# EAGLE design Turntable (EAGLE 9.5.2)
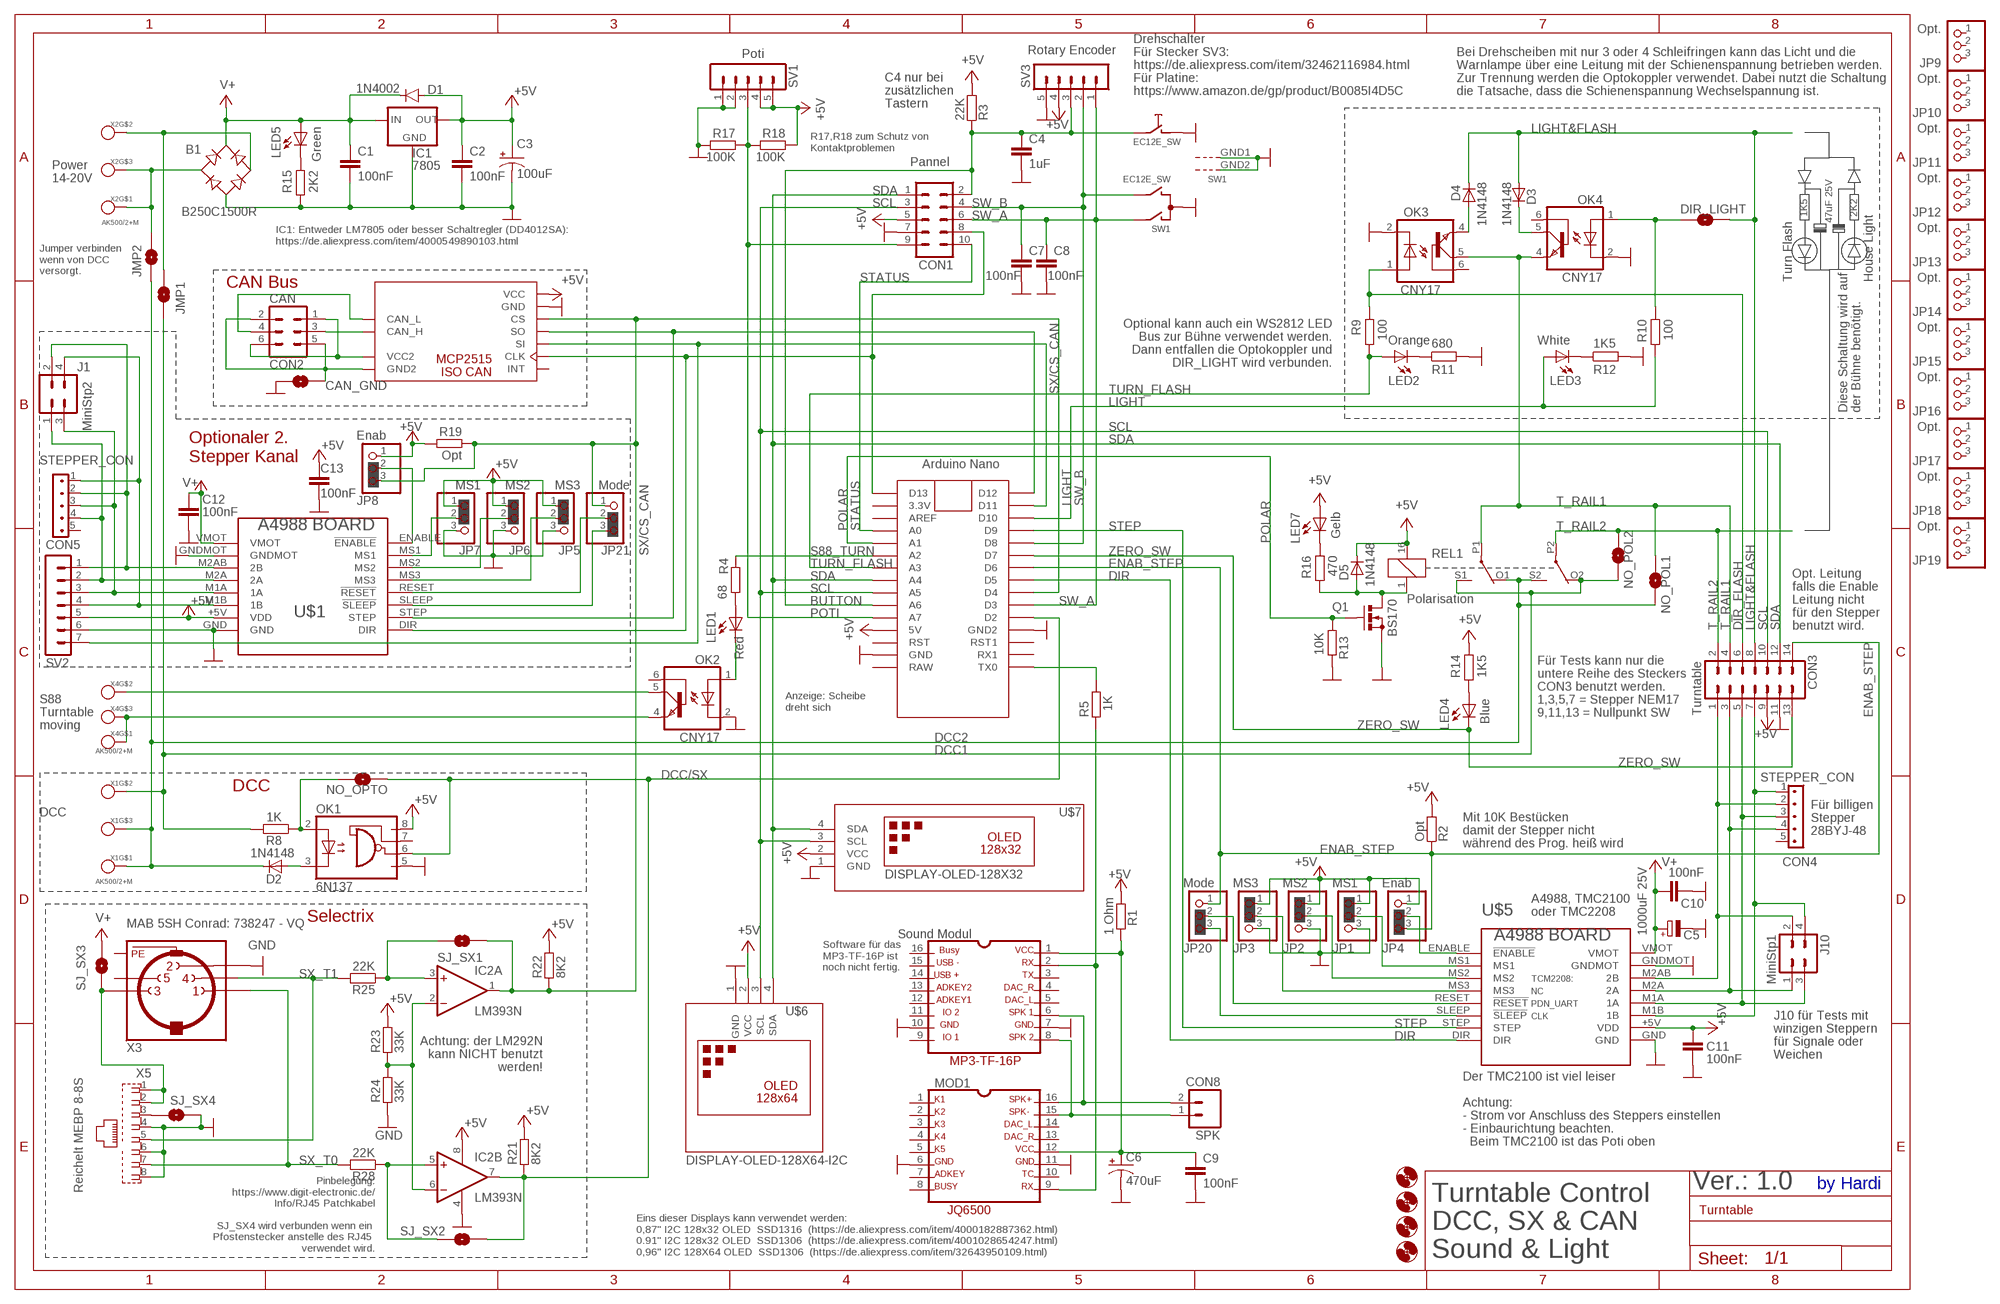
[diagram p0: schematic, sheet 1]

## Parts
B1  B250C1500R  RB1A  [RB1A]
C1  100nF  C-EU050-024X044  [C050-024X044]
C2  100nF  C-EU050-024X044  [C050-024X044]
C3  100uF  SPARKFUN-CAPACITORS_100UF-25V-20%(PTH)  [SPARKFUN-CAPACITORS_CPOL-RADIAL-100UF-25V]
C4  1uF  C-EU050-024X044  [C050-024X044]
C5  1000uF 25V  CPOL-EUE5-10.5  [E5-10,5]
C6  470uF  SPARKFUN-CAPACITORS_100UF-25V-20%(PTH)  [SPARKFUN-CAPACITORS_CPOL-RADIAL-100UF-25V]
C7  100nF  C-EU050-024X044  [C050-024X044]
C8  100nF  C-EU050-024X044  [C050-024X044]
C9  100nF  C-EU050-024X044  [C050-024X044]
C10  100nF  C-EU050-024X044  [C050-024X044]
C11  100nF  C-EU050-024X044  [C050-024X044]
C12  100nF  C-EU050-024X044  [C050-024X044]
C13  100nF  C-EU050-024X044  [C050-024X044]
CAN1  MCP2515_ISO_CAN  [MCP2515_ISO_CAN]
CAN_GND  SOLDERJUMPERNO  [SJ_2S-NO]
CON1  Pannel  ML10  [ML10]
CON2  CAN  ML6  [ML6]
CON3  Turntable  ML14  [ML14]
CON4  STEPPER_CON  [STEPPER_CON]
CON5  STEPPER_CON  [STEPPER_CON]
CON8  SPK  M02PTH  [1X02]
D1  1N4002  1N4004  [DO41-10]
D2  1N4148  1N4148DO35-7  [DO35-7]
D3  1N4148  1N4148DO35-7  [DO35-7]
D4  1N4148  1N4148DO35-7  [DO35-7]
D5  1N4148  1N4148DO35-7  [DO35-7]
DIR_LIGHT  SOLDERJUMPERNO  [SJ_2S-NO]
H1  MOUNT-HOLE3.0  [3,0]
H2  MOUNT-HOLE3.0  [3,0]
H3  MOUNT-HOLE3.0  [3,0]
H4  MOUNT-HOLE3.0  [3,0]
IC1  7805  78XXS  [78XXS]
IC2  LM393N  [DIL08]
J1  MiniStp2  CON-HARTING-ML_ML4  [CON-HARTING-ML_ML4]
J10  MiniStp1  CON-HARTING-ML_ML4  [CON-HARTING-ML_ML4]
JMP1  SOLDERJUMPERNO  [SJ_2S-NO]
JMP2  SOLDERJUMPERNO  [SJ_2S-NO]
JP1  MS1  PINHD-1X3CB  [1X03-CLEANBIG]
JP2  MS2  PINHD-1X3CB  [1X03-CLEANBIG]
JP3  MS3  PINHD-1X3CB  [1X03-CLEANBIG]
JP4  Enab  PINHD-1X3CB  [1X03-CLEANBIG]
JP5  MS3  PINHD-1X3CB  [1X03-CLEANBIG]
JP6  MS2  PINHD-1X3CB  [1X03-CLEANBIG]
JP7  MS1  PINHD-1X3CB  [1X03-CLEANBIG]
JP8  Enab  PINHD-1X3CB  [1X03-CLEANBIG]
JP9  Opt.  PINHD-1X3CB  [1X03-CLEANBIG]
JP10  Opt.  PINHD-1X3CB  [1X03-CLEANBIG]
JP11  Opt.  PINHD-1X3CB  [1X03-CLEANBIG]
JP12  Opt.  PINHD-1X3CB  [1X03-CLEANBIG]
JP13  Opt.  PINHD-1X3CB  [1X03-CLEANBIG]
JP14  Opt.  PINHD-1X3CB  [1X03-CLEANBIG]
JP15  Opt.  PINHD-1X3CB  [1X03-CLEANBIG]
JP16  Opt.  PINHD-1X3CB  [1X03-CLEANBIG]
JP17  Opt.  PINHD-1X3CB  [1X03-CLEANBIG]
JP18  Opt.  PINHD-1X3CB  [1X03-CLEANBIG]
JP19  Opt.  PINHD-1X3CB  [1X03-CLEANBIG]
JP20  Mode  PINHD-1X3CB  [1X03-CLEANBIG]
JP21  Mode  PINHD-1X3CB  [1X03-CLEANBIG]
LED1  Red  LED3MM  [LED3MM]
LED2  Orange  LED3MM  [LED3MM]
LED3  White  LED3MM  [LED3MM]
LED4  Blue  LED3MM  [LED3MM]
LED5  Green  LED3MM  [LED3MM]
LED7  Gelb  LED3MM  [LED3MM]
MOD1  JQ6500  [JQ6500]
MOD2  Sound Modul  MP3-TF-16P_MP3-TF-16P  [MP3-TF-16P_MP3-TF-16P]
NO_OPTO  SOLDERJUMPERNO  [SJ_2S-NO]
NO_POL1  SOLDERJUMPERNO  [SJ_2S-NO]
NO_POL2  SOLDERJUMPERNO  [SJ_2S-NO]
OK1  6N137  [DIL08]
OK2  CNY17  [DIL06]
OK3  CNY17  [DIL06]
OK4  CNY17  [DIL06]
Q1  BS170  [SOT54E]
R1  1 Ohm  RCL_R-EU_0204/7  [RCL_0204/7]
R2  Opt  R-EU_0204/7  [0204/7]
R3  22K  R-EU_0204/7  [0204/7]
R4  68  R0204/7  [0204/7]
R5  1K  R0204/7  [0204/7]
R8  1K  R0204/7  [0204/7]
R9  100  R0204/7  [0204/7]
R10  100  R0204/7  [0204/7]
R11  680  R0204/7  [0204/7]
R12  1K5  R0204/7  [0204/7]
R13  10K  R0204/7  [0204/7]
R14  1K5  R0204/7  [0204/7]
R15  2K2  R0204/7  [0204/7]
R16  470  R0204/7  [0204/7]
R17  100K  R-EU_0204/7  [0204/7]
R18  100K  R-EU_0204/7  [0204/7]
R19  Opt  R-EU_0204/7  [0204/7]
R21  8K2  R-EU_0204/7  [0204/7]
R22  8K2  R-EU_0204/7  [0204/7]
R23  33K  R-EU_0204/7  [0204/7]
R24  33K  R-EU_0204/7  [0204/7]
R25  22K  R-EU_0204/7  [0204/7]
R28  22K  R-EU_0204/7  [0204/7]
REL1  Polarisation  351  [351]
SJ_SX1  SOLDERJUMPERNO  [SJ_2S-NO]
SJ_SX2  SOLDERJUMPERNO  [SJ_2S-NO]
SJ_SX3  SOLDERJUMPERNO  [SJ_2S-NO]
SJ_SX4  SOLDERJUMPERNO  [SJ_2S-NO]
SV1  Poti  MA05-1  [MA05-1]
SV2  MA07-1  [MA07-1]
SV3  Rotary Encoder  MA05-1SMALL_PAD  [MA05-1_SMALL_PAD]
SW1  EC12E_SW  [ALPS_EC12E_SW]
U2  LED NANO  NANO  [NANO]
U$1  BOARD_A4988  [BOARD_A4988]
U$5  BOARD_A4988  [BOARD_A4988]
U$6  DISPLAY-OLED-128X64-I2C  [DISPLAY-OLED-128X64-I2C]
U$7  DISPLAY-OLED-128X32  [DISPLAY-OLED-128X32]
X1  AK500/2+M  [AK500/2+M]
X2  AK500/2+M  [AK500/2+M]
X3  MAB 5SH Conrad: 738247 - VQ  MAB5SH  [MAB5SH]
X4  AK500/2+M  [AK500/2+M]
X5  Reichelt MEBP 8-8S  RJ45_MEBP8-8S  [RJ45_MEBP8-8S]

## Nets
+5V: C2.1 C3.1(+) C11.1 C13.1 CON1.5 CON3.9 D1.A D5.C IC1.OUT IC2.8(P:V+) JP1.1 JP2.1 JP3.1 JP4.1 JP5.1 JP6.1 JP7.1 JP8.1 LED7.A OK1.8(VCC) R1.1 R2.2 R3.2 R14.1 R18.1 R19.2 R21.2 R22.2 R23.2 REL1.16 SV1.4 SV1.5 SV2.5 SV3.4 U2.5V U$1.+5V(VDD) U$5.+5V(VDD) U$6.2(VCC) U$7.2(VCC)
BUTTON: C4.1 CON1.2 R3.1 SV3.3 SW1.E U2.A6
CAN_H: CAN1.9(CAN_H) CON2.3
CAN_L: CAN1.8(CAN_L) CON2.4
D11: CAN1.5(SI) SV2.7 U2.D11
D12: CAN1.4(SO) U2.D12 U$1.STEP
DCC1: JMP1.2 NO_POL2.2 R8.2 REL1.O2(3:O) REL1.S1(2:S) X1.2
DCC2: D2.C JMP2.2 NO_POL1.2 REL1.O1(2:O) REL1.S2(3:S) X1.1 X1.M
DCC/SX: IC2.7(B:OUT) NO_OPTO.1 OK1.6(VO) R21.1 SJ_SX2.2 U2.D2
DIR: U2.D5 U$5.DIR
DIR_FLASH: CON3.6 OK3.1(A) R9.1
ENAB_STEP: CON3.14 JP4.3 JP20.1 R2.1 U2.D6
GND: B1.- C1.2 C2.2 C3.2(-) C4.2 C5.- C6.2(-) C7.2 C8.2 C9.2 C10.2 C11.2 C12.2 C13.2 CAN1.2(GND) CAN_GND.2 CON1.7 CON3.11 IC1.GND IC2.4(P:V-) JP1.3 JP2.3 JP3.3 JP5.3 JP6.3 JP7.3 MOD1.6 MOD1.11 MOD2.7 MOD2.10 OK1.5(GND) OK2.2(C) OK3.2(C) OK4.2(C) Q1.S R11.2 R12.2 R13.2 R15.2 R17.2 R24.1 SJ_SX4.2 SV1.1 SV1.2 SV2.6 SV3.5 SW1.C SW1.D SW1.GND1(G) SW1.GND2(G) U2.GND U2.GND1(GND2) U$1.GND U$1.GNDMOT U$5.GND U$5.GNDMOT U$6.1(GND) U$7.1(GND) X3.2 X5.4 X5.6 X5.8
LIGHT: LED3.A R10.2 U2.D10
LIGHT&FLASH: CON3.8 D3.A D4.C DIR_LIGHT.2
N$1: JP5.2 U$1.MS3
N$2: SJ_SX4.1 X5.3
N$3: CAN1.11(GND2) CAN_GND.1 CON2.2 CON2.5
N$4: C6.1(+) C9.1 MOD1.12 MOD2.1 R1.2
N$5: CAN1.6(CLK) CON1.8 U2.D13 U$1.DIR
N$6: CON8.1 MOD1.15 MOD2.8
N$7: MOD1.9 MOD2.2 R5.1
N$8: LED1.K(C) OK2.1(A)
N$9: CON8.2 MOD1.16 MOD2.6
N$10: CAN1.10(VCC2) CON2.1 CON2.6
N$11: R5.2 U2.TX0
N$12: B1.AC2 JMP1.1 X2.2
N$13: B1.AC1 JMP2.1 X2.1 X2.M
N$14: JP2.2 U$5.MS2
N$15: D2.A OK1.3(C)
N$16: LED2.K(C) R11.1
N$17: D5.A Q1.D R16.2 REL1.1
N$18: LED1.A R4.1
N$19: OK2.4(EMI) X4.1 X4.M
N$20: OK2.5(COL) X4.2
N$21: NO_OPTO.2 OK1.2(A) R8.1
N$22: JP1.2 U$5.MS1
N$23: LED3.K(C) R12.1
N$24: LED4.A R14.2
N$25: JP4.2 U$5.ENABLE(!ENABLE)
N$26: SJ_SX3.1 X3.3 X5.1 X5.2
N$27: JP3.2 U$5.MS3
N$28: D4.A OK3.4(EMI)
N$29: D3.C OK4.5(COL)
N$30: JP20.2 U$5.RESET(!RESET)
N$31: CON3.1 CON4.2 J10.2 U$5.M2AB(2B)
N$32: JP21.3 U$1.SLEEP(!SLEEP)
N$33: JP20.3 U$5.SLEEP(!SLEEP)
N$34: LED5.K(C) R15.1
N$35: CON3.7 CON4.1 J10.4 U$5.M1B(1B)
N$36: LED7.K(C) R16.1
N$37: DIR_LIGHT.1 OK4.1(A) R10.1
N$38: IC2.2(A:-IN) IC2.6(B:-IN) R23.1 R24.2
N$39: IC2.3(A:+IN) R25.1 SJ_SX1.1
N$40: CON3.3 CON4.4 J10.1 U$5.M2A(2A)
N$41: CON3.5 CON4.3 J10.3 U$5.M1A(1A)
N$42: IC2.5(B:+IN) R28.1 SJ_SX2.1
N$43: JP6.2 U$1.MS2
N$44: JP7.2 U$1.MS1
N$45: JP8.2 U$1.ENABLE(!ENABLE)
N$46: JP21.2 U$1.RESET(!RESET)
N$47: CON5.2 J1.2 SV2.1 U$1.M2AB(2B)
N$48: CON5.4 J1.1 SV2.2 U$1.M2A(2A)
N$49: CON5.3 J1.3 SV2.3 U$1.M1A(1A)
N$50: CON5.1 J1.4 SV2.4 U$1.M1B(1B)
POLAR: Q1.G R13.1 U2.A1
POTI: CON1.9 R17.1 R18.2 SV1.3 U2.A7
S88_TURN: R4.2 U2.A2
SCL: CON1.3 CON3.10 U2.A5 U$6.3(SCL) U$7.3(SCL)
SDA: CON1.1 CON3.12 U2.A4 U$6.4(SDA) U$7.4(SDA)
STATUS: CON1.10 U2.A0
STEP: U2.D9 U$5.STEP
SW_A: C8.1 CON1.6 SV3.1 SW1.A U2.D3
SW_B: C7.1 CON1.4 SV3.2 SW1.B U2.D8
SX/CS_CAN: CAN1.3(CS) IC2.1(A:OUT) JP8.3 JP21.1 R19.1 R22.1 SJ_SX1.2 U2.D4
SX_T0: R28.2 X3.1 X5.7
SX_T1: R25.2 X3.4 X5.5
T_RAIL1: CON3.4 NO_POL1.1 OK3.5(COL) OK4.4(EMI) REL1.P1(2:P)
T_RAIL2: CON3.2 NO_POL2.1 REL1.P2(3:P)
TURN_FLASH: LED2.A R9.2 U2.A3
V+: B1.+ C1.1 C5.+ C10.1 C12.1 D1.C IC1.IN LED5.A SJ_SX3.2 U$1.VMOT U$5.VMOT
VCC: CAN1.1(VCC) ; supply symbol labelled +5V
ZERO_SW: CON3.13 LED4.K(C) U2.D7
Unconnected: CAN1.7(INT) CON4.5 CON5.5 JP9.1 JP9.2 JP9.3 JP10.1 JP10.2 JP10.3 JP11.1 JP11.2 JP11.3 JP12.1 JP12.2 JP12.3 JP13.1 JP13.2 JP13.3 JP14.1 JP14.2 JP14.3 JP15.1 JP15.2 JP15.3 JP16.1 JP16.2 JP16.3 JP17.1 JP17.2 JP17.3 JP18.1 JP18.2 JP18.3 JP19.1 JP19.2 JP19.3 MOD1.1 MOD1.2 MOD1.3 MOD1.4 MOD1.5 MOD1.7 MOD1.8 MOD1.10 MOD1.13 MOD1.14 MOD2.3 MOD2.4 MOD2.5 MOD2.9 MOD2.11 MOD2.12 MOD2.13 MOD2.14 MOD2.15 MOD2.16 OK1.7(VE) OK2.6(BAS) OK3.6(BAS) OK4.6(BAS) U2.3.3V U2.AREF U2.RAW U2.RST U2.RST1 U2.RX1 X3.5

## Notes on the sheet
- Drehschalter
  Für Stecker SV3:
  https://de.aliexpress.com/item/32462116984.html
  Für Platine:
  https://www.amazon.de/gp/product/B0085I4D5C
- Bei Drehscheiben mit nur 3 oder 4 Schleifringen kann das Licht und die 
  Warnlampe über eine Leitung mit der Schienenspannung betrieben werden.
  Zur Trennung werden die Optokoppler verwendet. Dabei nutzt die Schaltung
  die Tatsache, dass die Schienenspannung Wechselspannung ist.
- C4 nur bei
  zusätzlichen
  Tastern
- R17,R18 zum Schutz von 
  Kontaktproblemen
- Power
  14-20V
- 1K5 | 2K2
- 47uF 25V
- IC1: Entweder LM7805 oder besser Schaltregler (DD4012SA):
  https://de.aliexpress.com/item/4000549890103.html
- Jumper verbinden
  wenn von DCC
  versorgt.
- CAN Bus
- Turn Flash | House Light
- Optional kann auch ein WS2812 LED
  Bus zur Bühne verwendet werden.
  Dann entfallen die Optokoppler und
  DIR_LIGHT wird verbunden.
- Diese Schaltung wird auf
  der Bühne benötigt.
- Optionaler 2.
  Stepper Kanal
- Opt. Leitung
  falls die Enable
  Leitung nicht 
  für den Stepper
  benutzt wird.
- Anzeige: Scheibe 
  dreht sich
- Für Tests kann nur die
  untere Reihe des Steckers
  CON3 benutzt werden.
  1,3,5,7 = Stepper NEM17
  9,11,13 = Nullpunkt SW
- S88
  Turntable
  moving
- DCC
- DCC
- Für billigen
  Stepper
  28BYJ-48
- Mit 10K Bestücken
  damit der Stepper nicht
  während des Prog. heiß wird
- Selectrix
- A4988, TMC2100
  oder TMC2208
- Software für das
  MP3-TF-16P ist 
  noch nicht fertig.
- TCM2208:
  NC
  PDN_UART
  CLK
- J10 für Tests mit
  winzigen Steppern
  für Signale oder
  Weichen
- Achtung: der LM292N
  kann NICHT benutzt
  werden!
- Der TMC2100 ist viel leiser
  
  Achtung: 
  - Strom vor Anschluss des Steppers einstellen
  - Einbaurichtung beachten.
    Beim TMC2100 ist das Poti oben
- Pinbelegung:
  https://www.digit-electronic.de/
  Info/RJ45 Patchkabel
  
  SJ_SX4 wird verbunden wenn ein 
  Pfostenstecker anstelle des RJ45 
  verwendet wird.
- Ver.: 1.0 | by Hardi
- Eins dieser Displays kann verwendet werden:
  0,87" I2C 128x32 OLED  SSD1316  (https://de.aliexpress.com/item/4000182887362.html)
  0.91" I2C 128x32 OLED  SSD1306  (https://de.aliexpress.com/item/4001028654247.html)
  0,96" I2C 128X64 OLED  SSD1306  (https://de.aliexpress.com/item/32643950109.html)
- Turntable Control
  DCC, SX & CAN
  Sound & Light

## Power pins joined to a net without a drawn wire
PE: X3.PE X3.PE@(PE)

## Library data of the parts
B1 = rectifier:RB1A: RECTIFIER 1 A
C1 C2 C4 C7-C13 = resistor:C-EU: CAPACITOR, European symbol
C3 C6 = Sound_MP3-TF-16P_and_WS2811:SPARKFUN-CAPACITORS_100UF-25V-20%(PTH): CAP-08439; PROD_ID: CAP-08439
C5 = resistor:CPOL-EU: POLARIZED CAPACITOR, European symbol
CAN1 = Arduino_fuer_LEDs_DCC_2_All:MCP2515_ISO_CAN: MCP2515 CAN Modul
CAN_GND DIR_LIGHT JMP1 JMP2 NO_OPTO NO_POL1 NO_POL2 SJ_SX1-SJ_SX4 = SparkFun-Retired:SOLDERJUMPER: Solder Jumper Standard SMD solder jumper. Used to automate production. Two varients : Normally Open and Normally Closed are the same, but have different paste layers. NC will have a large amount of paste and should jumper during reflow.
CON1 = con-harting-ml:ML10: HARTING; OC_FARNELL: unknown; OC_NEWARK: unknown
CON2 = Arduino_fuer_LEDs_DCC_2:ML6: HARTING; OC_FARNELL: unknown; OC_NEWARK: unknown
CON3 = Arduino_fuer_LEDs_DCC_2:ML14: HARTING; OC_FARNELL: unknown; OC_NEWARK: unknown
CON4 CON5 = Connectors_Inline3_7:STEPPER_CON
CON8 = SparkFun-Connectors:M02: Standard 2-pin 0.1" header. Use with - straight break away headers ( PRT-00116) - right angle break away headers (PRT-00553) - swiss pins (PRT-00743) - machine pins (PRT-00117) - female headers (PRT-00115) Molex polarized connector foot print use with: PRT-08233 with associated crimp pins and housings. 2.54_SCREWTERM for use with PRT-10571. 3.5mm Screw Terminal footprints for PRT-08084 5mm Screw Terminal footprints for use with PRT-08432
D1 = diode:1N4004: DIODE general purpose rectifier, 1 A
D2-D5 = diode:1N4148: DIODE high speed (Philips)
H1-H4 = holes:MOUNT-HOLE: MOUNTING HOLE with drill center marker
IC1 = v-reg:78XXS: VOLTAGE REGULATOR
IC2 = linear:LM393: COMPARATOR
J1 J10 = Pfostenstecker_4_u_6:CON-HARTING-ML_ML4
JP1-JP21 = adafruit:PINHD-1X3: PIN HEADER
LED1-LED5 LED7 = Arduino_fuer_LEDs_DCC_2:LED: LED OSRAM: - CHIPLED LG R971, LG N971, LY N971, LG Q971, LY Q971, LO R971, LY R971 LH N974, LH R974 LS Q976, LO Q976, LY Q976 LO Q996 - Hyper CHIPLED LW Q18S LB Q993, LB Q99A, LB R99A - SideLED LS A670, LO A670, LY A670, LG A670, LP A670 LB A673, LV A673, LT A673, LW A673 LH A674 LY A675 LS A676, LA A676, LO A676, LY A676, LW A676 LS A679, LY A679, LG A679 - Hyper Micro SIDELED® LS Y876, LA Y876, LO Y876, LY Y876 LT Y87S - SmartLED LW L88C, LW L88S LB L89C, LB L89S, LG L890 LS L89K, LO L89K, LY L89K LS L896, LA L896, LO L896, LY L896 - TOPLED LS T670, LO T670, LY T670, LG T670, LP T670 LSG T670, LSP T670, LSY T670, LOP T670, LYG T670 LG T671, LOG T671, LSG T671 LB T673, LV T673, LT T673, LW T673 LH T674 LS T676, LA T676, LO T676, LY T676, LB T676, LH T676, LSB T676, LW T676 LB T67C, LV T67C, LT T67C, LS T67K, LO T67K, LY T67K, LW E67C LS E67B, LA E67B, LO E67B, LY E67B, LB E67C, LV E67C, LT E67C LW T67C LS T679, LY T679, LG T679 LS T770, LO T770, LY T770, LG T770, LP T770 LB T773, LV T773, LT T773, LW T773 LH T774 LS E675, LA E675, LY E675, LS T675 LS T776, LA T776, LO T776, LY T776, LB T776 LHGB T686 LT T68C, LB T68C - Hyper Mini TOPLED® LB M676 - Mini TOPLED Santana® LG M470 LS M47K, LO M47K, LY M47K Source: http://www.osram.convergy.de LUXEON: - LUMILED® LXK2-PW12-R00, LXK2-PW12-S00, LXK2-PW14-U00, LXK2-PW14-V00 LXK2-PM12-R00, LXK2-PM12-S00, LXK2-PM14-U00 LXK2-PE12-Q00, LXK2-PE12-R00, LXK2-PE12-S00, LXK2-PE14-T00, LXK2-PE14-U00 LXK2-PB12-K00, LXK2-PB12-L00, LXK2-PB12-M00, LXK2-PB14-N00, LXK2-PB14-P00, LXK2-PB14-Q00 LXK2-PR12-L00, LXK2-PR12-M00, LXK2-PR14-Q00, LXK2-PR14-R00 LXK2-PD12-Q00, LXK2-PD12-R00, LXK2-PD12-S00 LXK2-PH12-R00, LXK2-PH12-S00 LXK2-PL12-P00, LXK2-PL12-Q00, LXK2-PL12-R00 Source: www.luxeon.com KINGBRIGHT: KA-3528ASYC Source: www.kingbright.com
MOD1 = Sound_JQ6500:JQ6500: MP3-TF-16P http://www.electronicoscaldas.com/datasheet/DFR0299-DFPlayer-Mini-Manual.pdf; OC_FARNELL: unknown; OC_NEWARK: unknown
MOD2 = Sound_MP3-TF-16P_WS2811_and_ATTiny:MP3-TF-16P_MP3-TF-16P: MP3-TF-16P http://www.electronicoscaldas.com/datasheet/DFR0299-DFPlayer-Mini-Manual.pdf; OC_FARNELL: unknown; OC_NEWARK: unknown
OK1 = Arduino_fuer_LEDs_DCC_2:6N137: MOTOROLA OPTO COUPLER; MPN: 6N137; OC_FARNELL: 1328376; OC_NEWARK: 52M1895
OK2-OK4 = Arduino_fuer_LEDs_DCC_2:CNY17: SIEMENS OPTO COUPLER; MPN: CNY17-1; OC_FARNELL: 1045399; OC_NEWARK: 05M4044
Q1 = transistor-small-signal:BS170: N-CHANNEL MOS FET
R1 = Sound_MP3-TF-16P_and_WS2811:RCL_R-EU_: RESISTOR, European symbol; SPICEPREFIX: R
R2 R3 R17-R19 R21-R25 R28 = rcl:R-EU_: RESISTOR, European symbol
R4 R5 R8-R16 = Arduino_fuer_LEDs_DCC_2:R: RESISTOR, European symbol; SPICEMODEL: NONE; SPICEPREFIX: R
REL1 = relay:351: RELAY 2 x switch, Omron; OC_FARNELL: unknown; OC_NEWARK: unknown
SV1 = con-lstb:MA05-1: PIN HEADER; OC_FARNELL: unknown; OC_NEWARK: unknown
SV2 = con-lstb:MA07-1: PIN HEADER; OC_FARNELL: unknown; OC_NEWARK: unknown
SV3 = con-lstb:MA05-1: PIN HEADER
SW1 = switch-alps:EC12E_SW: ALPS rotary Encoder EC12E series with switch; MPN: EC12E2424407; OC_FARNELL: 1520813; OC_NEWARK: 74M1068
U2 = Arduino_fuer_LEDs_DCC_2:NANO: Arduino Nano
U$1 U$5 = Clean-Kong:BOARD_A4988
U$6 = diy-modules:DISPLAY-OLED-128X64-I2C: 128x64 Dot Matrix OLED Module based on SSD1306 chip Variant with I2C interface More details available here: http://www.instructables.com/id/Monochrome-096-i2c-OLED-display-with-arduino-SSD13/ SSD1306 datasheet: https://cdn-shop.adafruit.com/datasheets/SSD1306.pdf Click here to find device on ebay.com <http://www.ebay.com/sch/oled+display+128x64+iic> Note: There are two variants: I2C and SPI. Search for the proper version.
U$7 = diy-modules:DISPLAY-OLED-128X32: 128x32 Dot Matrix OLED Module with I2C interface based on SSD1306 chip More details available here: http://www.tinyosshop.com/index.php?route=product/product&product_id=953 Schematic available here: http://www.tinyosshop.com/datasheet/OLED%2012832.pdf SSD1306 datasheet: https://cdn-shop.adafruit.com/datasheets/SSD1306.pdf Click here to find device on ebay.com <http://www.ebay.com/sch/oled+display+128x32+i2c>
X1 X2 X4 = Arduino_fuer_LEDs_DCC_2:AK500/2+M
X3 = con-hirschmann:MAB5SH: Female CONNECTOR 5 pins 90 deg. with shield, horizontal (DIN 41524); OC_FARNELL: 809883; OC_NEWARK: unknown
X5 = RJ45_Reichelt:RJ45_MEBP8-8S: AMP connector

## Board
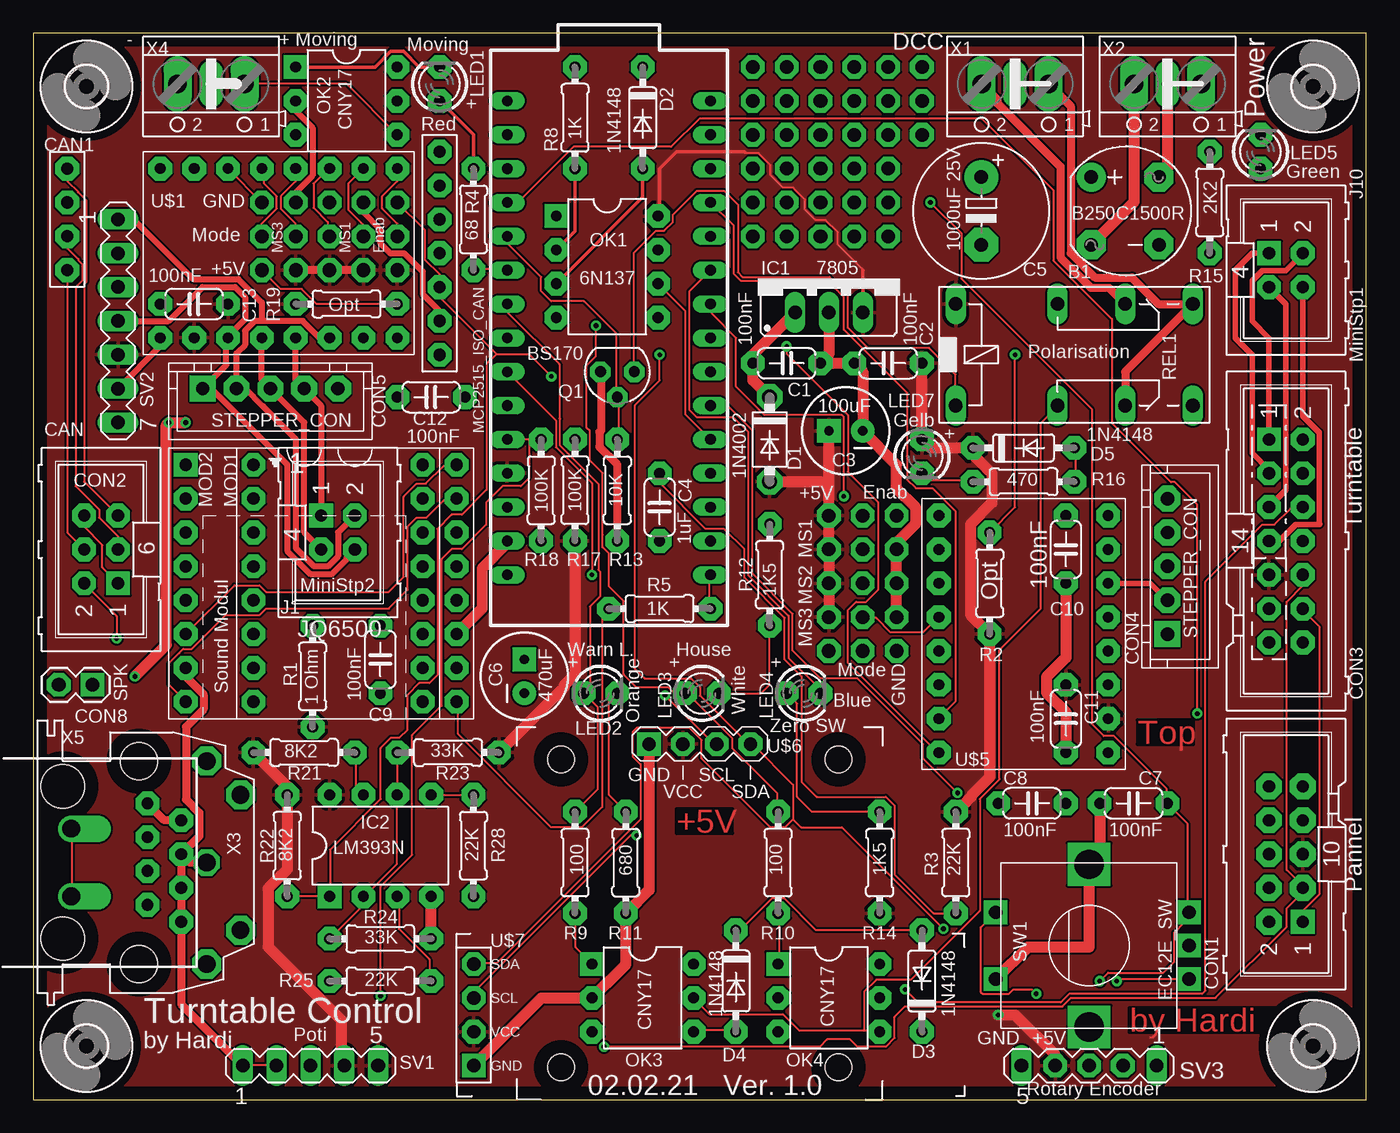
[diagram p1: board, top side]
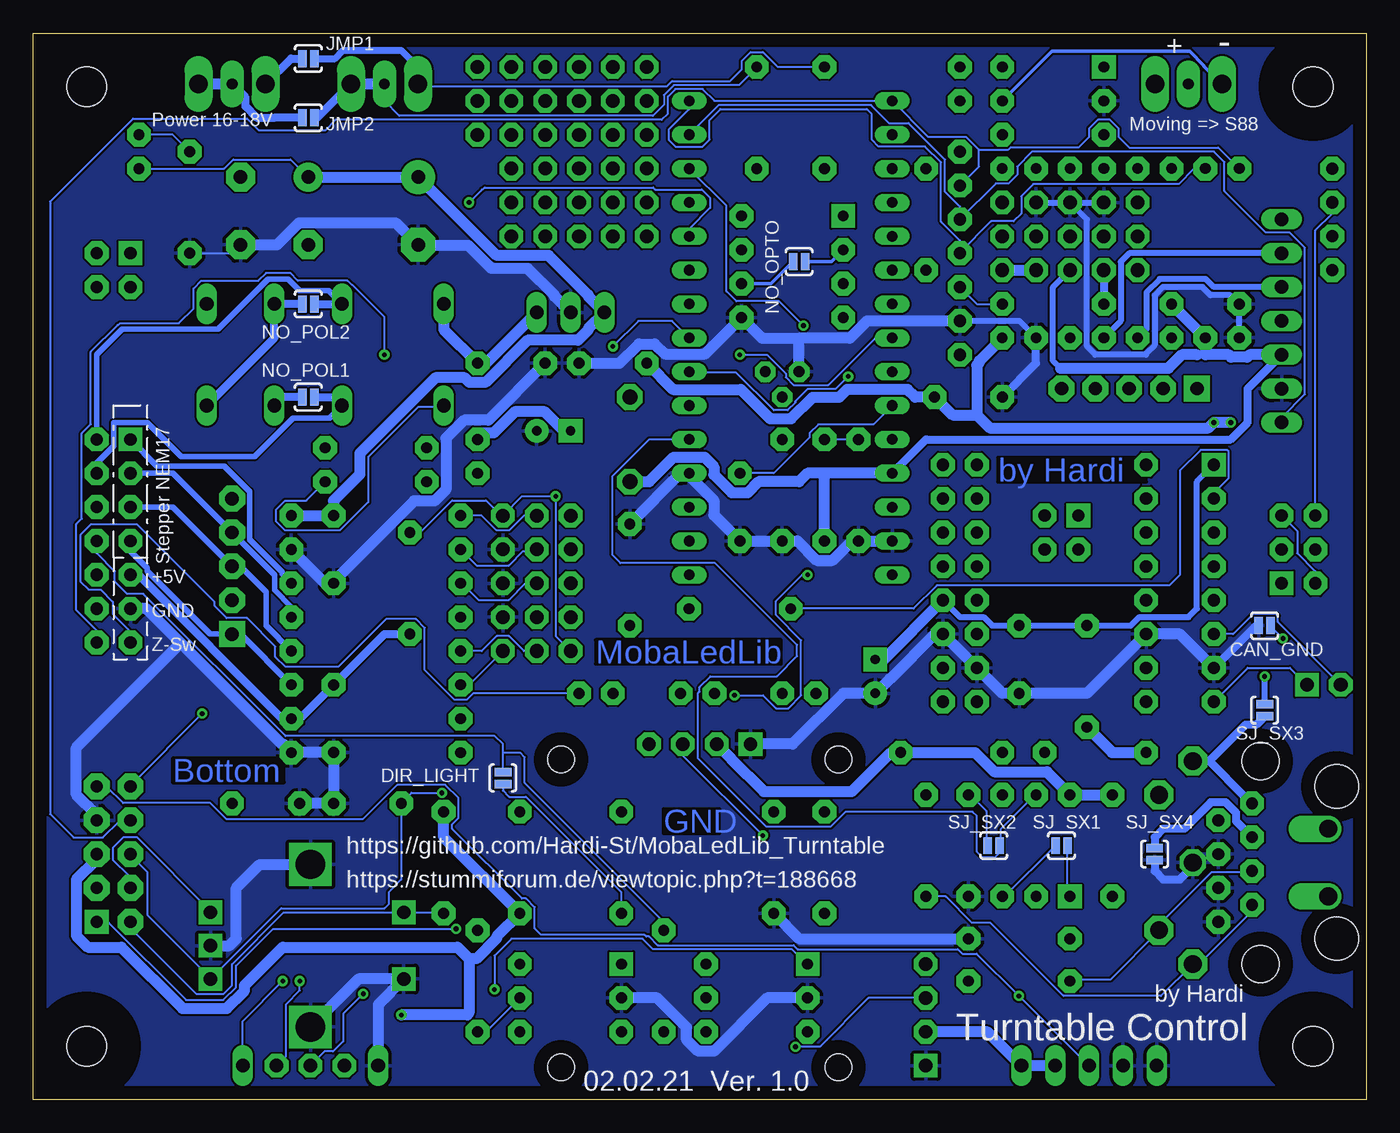
[diagram p2: board, bottom side, seen from below]

Size 100 x 80 mm. Coordinates in mm from the lower left corner, seen from the top.
Outline: 0,0 100,0 100,80 0,80 0,0
Copper layers (1*16): Top 0.035mm / dielectric 1.5mm / Bottom 0.035mm
Design rules "default *": minimum track width 6mil, minimum drill 0.35mm, track to track 6mil, track to pad 6mil, pad to pad 6mil, via to via 6mil, smd to smd 6mil, copper to edge 40mil, drill to drill 6mil, minimum pad ring 10mil, minimum via ring 8mil, stop-mask expansion 4mil, vias tented up to drill 0.5mm, thermal gap 10mil

### Footprints (pad centres in the part's own frame; a part is rotated, then mirrored left to right if it is on the bottom)
RB1A = drill 1.016 pad 2.184: + -2.54,2.54 | drill 1.016 pad 2.184 octagon: - 2.54,-2.54; AC1 2.54,2.54; AC2 -2.54,-2.54
C050-024X044 = drill 0.813 pad 1.778 octagon: 1 -2.54,0; 2 2.54,0
SPARKFUN-CAPACITORS_CPOL-RADIAL-100UF-25V = drill 0.7 pad 1.778 square: 1 1.27,0 | drill 0.7 pad 1.778: 2 -1.27,0
E5-10,5 = drill 1.016 pad 2.54: + -2.54,0 | drill 1.016 pad 2.54 octagon: - 2.54,0
MCP2515_ISO_CAN = drill 0.914 pad 1.778 octagon: 1 0,0; 2 0,-2.54; 3 0,-5.08; 4 0,-7.62; 5 0,-10.16; 6 0,-12.7; 7 0,-15.24; 8 27.94,-6.35; 9 27.94,-8.89; 10 27.94,-11.43; 11 27.94,-13.97
SJ_2S-NO = smd 0.635 x 1.27: 1 -0.45,0; 2 0.45,0
ML10 = drill 0.914 pad 1.778 square: 1 -5.08,-1.27 | drill 0.914 pad 1.93 octagon: 2 -5.08,1.27; 3 -2.54,-1.27; 4 -2.54,1.27; 5 0,-1.27; 6 0,1.27; 7 2.54,-1.27; 8 2.54,1.27; 9 5.08,-1.27; 10 5.08,1.27
ML6 = drill 0.914 pad 1.778 square: 1 -2.54,-1.27 | drill 0.914 pad 1.778 octagon: 2 -2.54,1.27; 3 0,-1.27; 4 0,1.27; 5 2.54,-1.27; 6 2.54,1.27
ML14 = drill 0.914 pad 1.778 square: 1 -7.62,-1.27 | drill 0.914 pad 1.778 octagon: 2 -7.62,1.27; 3 -5.08,-1.27; 4 -5.08,1.27; 5 -2.54,-1.27; 6 -2.54,1.27; 7 0,-1.27; 8 0,1.27; 9 2.54,-1.27; 10 2.54,1.27; 11 5.08,-1.27; 12 5.08,1.27; 13 7.62,-1.27; 14 7.62,1.27
STEPPER_CON = drill 1 pad 1.93 square: 1 0,0 | drill 1 pad 1.93 octagon: 2 2.54,0; 3 5.08,0; 4 7.62,0; 5 10.16,0
1X02 = drill 1.016 pad 1.778 square: 1 0,0 | drill 1.016 pad 1.778 octagon: 2 2.54,0
DO41-10 = drill 1.118 pad 1.93 octagon: A 3.175,0; C -3.175,0
DO35-7 = drill 0.813 pad 1.778 octagon: A 3.81,0; C -3.81,0
3,0 = hole 3: 0,0
78XXS = drill 1.016 long: GND 0,-2.54; IN -2.54,-2.54; OUT 2.54,-2.54
DIL08 = drill 0.813 pad 1.778 square: 1 -3.81,-3.81 | drill 0.813 pad 1.778 octagon: 2 -1.27,-3.81; 3 1.27,-3.81; 4 3.81,-3.81; 5 3.81,3.81; 6 1.27,3.81; 7 -1.27,3.81; 8 -3.81,3.81
CON-HARTING-ML_ML4 = drill 0.914 pad 1.778 square: 1 -2.54,-1.27 | drill 0.914 pad 1.778 octagon: 2 -2.54,1.27; 3 0,-1.27; 4 0,1.27
1X03-CLEANBIG = drill 1.016 pad 1.778 octagon: 1 -2.54,0; 2 0,0; 3 2.54,0
LED3MM = drill 0.813 pad 1.778 octagon: A -1.27,0; K 1.27,0
JQ6500 = drill 0.914 pad 1.778 octagon: 1 -8.89,16.51; 2 -8.89,13.97; 3 -8.89,11.43; 4 -8.89,8.89; 5 -8.89,6.35; 6 -8.89,3.81; 7 -8.89,1.27; 8 -8.89,-1.27; 9 6.35,-1.27; 10 6.35,1.27; 11 6.35,3.81; 12 6.35,6.35; 13 6.35,8.89; 14 6.35,11.43; 15 6.35,13.97; 16 6.35,16.51
MP3-TF-16P_MP3-TF-16P = drill 0.914 pad 1.778 square: 1 -8.89,16.51 | drill 0.914 pad 1.778 octagon: 2 -8.89,13.97; 3 -8.89,11.43; 4 -8.89,8.89; 5 -8.89,6.35; 6 -8.89,3.81; 7 -8.89,1.27; 8 -8.89,-1.27; 9 8.89,-1.27; 10 8.89,1.27; 11 8.89,3.81; 12 8.89,6.35; 13 8.89,8.89; 14 8.89,11.43; 15 8.89,13.97; 16 8.89,16.51
DIL06 = drill 0.813 pad 1.778 square: 1 -2.54,-3.81 | drill 0.813 pad 1.778 octagon: 2 0,-3.81; 3 2.54,-3.81; 4 2.54,3.81; 5 0,3.81; 6 -2.54,3.81
SOT54E = drill 0.813 pad 1.524 octagon: D -1.27,0; G 0,1.905; S 1.27,0
RCL_0204/7 = drill 0.813 pad 1.778 octagon: 1 -3.81,0; 2 3.81,0
0204/7 = drill 0.813 pad 1.778 octagon: 1 -3.81,0; 2 3.81,0
351 = drill 1.016 long: 1 -3.81,-3.81; 16 -3.81,3.81; O1 8.89,-3.81; O2 8.89,3.81; P1 3.81,-3.81; P2 3.81,3.81; S1 13.97,-3.81; S2 13.97,3.81
MA05-1 = drill 1.016 long: 1 -5.08,0; 2 -2.54,0; 3 0,0; 4 2.54,0; 5 5.08,0
MA07-1 = drill 1.016 long: 1 -7.62,0; 2 -5.08,0; 3 -2.54,0; 4 0,0; 5 2.54,0; 6 5.08,0; 7 7.62,0
MA05-1_SMALL_PAD = drill 1.016 long: 1 -5.08,0; 5 5.08,0 | drill 1.016 pad 1.778 octagon: 2 -2.54,0; 3 0,0; 4 2.54,0
ALPS_EC12E_SW = drill 1 pad 1.778 square: A -2.5,-7.5; B 2.5,-7.5; C 0,-7.5; D -2.5,7; E 2.5,7 | drill 2.2 square: GND1 -6.1,0; GND2 6.1,0
NANO = drill 0.8 long: 3.3V -10.16,24.13; 5V -10.16,-1.27; A0 -10.16,19.05; A1 -10.16,16.51; A2 -10.16,13.97; A3 -10.16,11.43; A4 -10.16,8.89; A5 -10.16,6.35; A6 -10.16,3.81; A7 -10.16,1.27; AREF -10.16,21.59; D2 5.08,1.27; D3 5.08,3.81; D4 5.08,6.35; D5 5.08,8.89; D6 5.08,11.43; D7 5.08,13.97; D8 5.08,16.51; D9 5.08,19.05; D10 5.08,21.59; D11 5.08,24.13; D12 5.08,26.67; D13 -10.16,26.67; GND -10.16,-6.35; GND1 5.08,-1.27; RAW -10.16,-8.89; RST -10.16,-3.81; RST1 5.08,-3.81; RX1 5.08,-6.35; TX0 5.08,-8.89
BOARD_A4988 = drill 0.8 pad 1.778 octagon: +5V 1.27,16.51; DIR 13.97,19.05; ENABLE 13.97,1.27; GND 1.27,19.05; GNDMOT 1.27,3.81; M1A 1.27,11.43; M1B 1.27,13.97; M2A 1.27,8.89; M2AB 1.27,6.35; MS1 13.97,3.81; MS2 13.97,6.35; MS3 13.97,8.89; RESET 13.97,11.43; SLEEP 13.97,13.97; STEP 13.97,16.51; VMOT 1.27,1.27
DISPLAY-OLED-128X64-I2C = drill 1 pad 1.778 square: 1 -3.81,12.7 | drill 1 pad 1.778 octagon: 2 -1.27,12.7; 3 1.27,12.7; 4 3.81,12.7 | hole 2: -10.414,11.557; 10.414,11.557; 10.414,-11.557; -10.414,-11.557
DISPLAY-OLED-128X32 = drill 1 pad 1.778 square: 1 -17.78,-3.81 | drill 1 pad 1.778 octagon: 2 -17.78,-1.27; 3 -17.78,1.27; 4 -17.78,3.81
AK500/2+M = drill 1.397 long: 1 -2.515,0; 2 2.515,0 | drill 0.813 pad 1.778 long: M 0,0
MAB5SH = drill 1.321 pad 2.184 octagon: 1 7.62,5.08; 3 -7.62,5.08; 4 5.08,7.62; 5 -5.08,7.62 | drill 1.321 octagon: 2 0,5.08 | drill 1.321 offset: PE -2.54,-5.08; PE@ 2.54,-5.08 | hole 2.794: 7.62,0; -7.62,0
RJ45_MEBP8-8S = drill 0.889 pad 1.778 octagon: 1 -4.445,6.35; 2 -3.175,8.89; 3 -1.905,6.35; 4 -0.635,8.89; 5 0.635,6.35; 6 1.905,8.89; 7 3.175,6.35; 8 4.445,8.89 | hole 3.251: -5.715,0; 5.715,0

### Placement (x,y rotation side)
B1  81.92,66.67 0 top
C1  56.52,55.24 0 top
C2  64.14,55.24 180 top
C3  60.96,50.16 180 top
C4  46.99,44.45 270 top
C5  71.12,66.67 270 top
C6  36.83,31.75 90 top
C7  82.55,22.23 180 top
C8  74.93,22.23 0 top
C9  26.04,33.02 270 top
C10  77.47,41.27 270 top
C11  77.47,28.57 270 top
C12  29.84,52.7 180 top
C13  12.06,59.69 180 top
CAN1  30.48,55.88 180 top
CAN_GND  7.62,35.56 180 bottom
CON1  93.98,18.41 90 top
CON2  5.08,41.27 90 top
CON3  93.98,41.91 270 top
CON4  85.09,34.92 90 top
CON5  12.7,53.34 0 top
CON8  4.45,31.11 180 top
D1  55.24,49.53 270 top
D2  45.72,73.66 270 top
D3  66.67,8.89 90 top
D4  52.7,8.89 270 top
D5  74.3,48.9 0 top
DIR_LIGHT  64.77,24.13 90 bottom
H1  96,76 0 top
H2  4,76 0 top
H3  96,4 0 top
H4  4,4 0 top
IC1  59.69,61.59 0 top
IC2  26.04,19.05 0 top
J1  22.86,41.27 270 top
J10  93.98,60.96 270 top
JMP1  79.38,78.11 0 bottom
JMP2  79.38,73.66 0 bottom
JP1  62.23,41.27 0 top
JP2  62.23,38.73 0 top
JP3  62.23,36.2 0 top
JP4  62.23,43.81 0 top
JP5  19.68,64.77 90 top
JP6  22.23,64.77 90 top
JP7  24.77,64.77 90 top
JP8  27.3,64.77 90 top
JP9  56.52,77.47 0 top
JP10  56.52,74.93 0 top
JP11  64.14,77.47 0 top
JP12  56.52,69.85 180 top
JP13  56.52,72.39 0 top
JP14  64.14,72.39 0 top
JP15  64.14,74.93 0 top
JP16  56.52,67.31 0 top
JP17  56.52,64.77 0 top
JP18  61.59,67.31 90 top
JP19  64.14,67.31 90 top
JP20  62.23,33.66 0 top
JP21  17.14,64.77 90 top
LED1  30.48,76.2 90 top
LED2  42.55,30.48 0 top
LED3  50.16,30.48 0 top
LED4  57.78,30.48 0 top
LED5  92.08,71.12 90 top
LED7  66.67,48.26 270 top
MOD1  25.4,31.11 0 top
MOD2  20.32,31.11 0 top
NO_OPTO  42.55,62.87 0 bottom
NO_POL1  79.38,52.7 180 bottom
NO_POL2  79.38,59.69 180 bottom
OK1  43.05,62.48 270 top
OK2  23.5,74.93 270 top
OK3  45.72,7.62 270 top
OK4  59.69,7.62 270 top
Q1  43.81,54.61 180 top
R1  20.95,31.75 90 top
R2  71.75,38.73 270 top
R3  69.22,17.78 90 top
R4  33.02,66.04 270 top
R5  46.99,36.83 0 top
R8  40.64,73.66 90 top
R9  40.64,17.78 90 top
R10  55.88,17.78 90 top
R11  44.45,17.78 270 top
R12  55.24,39.37 90 top
R13  43.81,45.72 270 top
R14  63.5,17.78 90 top
R15  88.27,67.31 270 top
R16  74.3,46.35 0 top
R17  38.1,45.72 270 top
R18  40.64,45.72 90 top
R19  23.5,59.69 180 top
R21  20.32,26.04 180 top
R22  19.05,19.05 90 top
R23  31.11,26.04 0 top
R24  26.04,12.06 180 top
R25  26.04,8.89 180 top
R28  33.02,19.05 270 top
REL1  73.03,55.88 0 top
SJ_SX1  22.86,19.05 0 bottom
SJ_SX2  27.94,19.05 0 bottom
SJ_SX3  7.62,29.21 90 bottom
SJ_SX4  15.88,18.41 270 bottom
SV1  20.79,2.54 0 top
SV2  6.35,58.42 270 top
SV3  79.21,2.54 180 top
SW1  79.21,11.54 90 top
U2  45.72,48.26 0 top
U$1  28.57,55.88 90 top
U$5  81.92,45.09 180 top
U$6  50,13.97 0 top
U$7  50.82,6.35 0 top
X1  73.66,76.2 180 top
X2  85.09,76.2 180 top
X3  7.92,17.78 270 top
X4  13.34,76.2 180 top
X5  2.21,17.78 270 top

### Tracks (layer width: path | path; a pad name or v marks a point on that pad's centre or on a via)
+5V  (via drill 0.35)
  Top 0.152: 53.34,71.12 53.34,71.02 54.41,71.02 55.32,70.1 55.32,69.34 56.24,68.43 57,68.43 57.91,67.51 57.91,66.75 58.67,65.99 59.44,65.99 60.35,65.08 60.35,64.16 62.18,62.33 62.23,62.23
  Top 0.254: OK1.8 46.99,66.42 46.99,69.85 48.26,71.12 53.34,71.12 | 62.23,62.23 IC1.OUT
  Top 0.61: 23.09,2.77 SV1.4 | JP7.1 JP6.1 JP5.1
  Top 0.813: R18.1 40.64,31.89 39.83,31.08 39.83,30.94 R23.2 | R21.2 19.05,23.5 R22.2 19.05,17.29 17.6,15.84 17.6,11.46 23.09,5.97 23.09,2.77 | R3.2 69.7,22.07 69.73,22.07 70.38,22.73 70.38,22.82 71.75,24.19 R2.2 70.31,36.37 70.31,43.16 71.93,44.78 71.93,46.95 70.48,48.4 D5.C 67.31,48.9 LED7.A C2.1 | JP3.1 JP2.1 JP1.1 JP4.1 59.69,46.35 | v72.39,6.35 73.66,6.35 76.67,3.34 SV3.4 | 59.69,46.35 C3.1 | D1.A 59.69,46.35
  Bottom 0.457: JP6.1 23.5,60.96 23.5,55.42 22.94,54.86 | 12.06,55.88 12.7,55.88
  Bottom 0.61: CON3.9 92.11,39.37 81.32,28.57 U$5.+5V 80.01,28.57 C11.1 73.66,34.92 R2.2 | U2.5V 33.02,49.53 10.16,49.53 8.89,50.8 8.89,53.34 SV2.5 | JP5.1 R19.2
  Bottom 0.813: REL1.16 69.22,57.78 C2.1 66.04,55.24 IC1.OUT | D1.A 53.8,46.35 51.96,48.2 49.64,48.2 48.93,47.49 48.93,46.89 47.59,45.54 46.39,45.54 45.58,46.35 42.55,46.35 41.91,46.99 40.64,46.99 | U$6.2 47.64,25.58 47.64,25.55 45.19,23.11 38.58,23.11 35.65,26.04 R23.2 29.35,26.04 27.91,24.59 23.95,24.59 IC2.8 R22.2 | R1.1 19.05,26.04 R21.2 | SV1.4 SV1.5 28.41,5.08 U$7.2 | R3.2 69.22,19.68 R14.1 65.23,12.24 65.23,12.1 66.76,10.57 67.31,10.57 | CON1.5 95.25,18.03 96.77,16.51 96.77,12.29 95.91,11.43 93.41,11.43 88.81,6.83 85.49,6.83 84.15,8.17 84.15,8.56 81.28,11.43 68.17,11.43 67.31,10.57 | LED7.A 66.19,50.01 65.46,50.01 63.86,51.61 61.63,51.61 60.18,50.16 C3.1 | SV2.5 8.75,55.88 8.93,55.7 10.12,55.7 10.3,55.88 12.06,55.88 U$1.+5V C13.1 | 12.7,55.88 13.83,55.88 14.84,54.86 22.94,54.86 | 67.31,10.57 67.31,6.49 67.45,6.35 v72.39,6.35 | JP8.1 JP7.1 | U2.5V 40.64,46.99 | R18.1 40.64,46.99
  pour Top: 0,80.01 100.33,80.01 100.33,0 0,0
BUTTON  (via drill 0.35)
  Top 0.152: C4.1 46.99,46.28 50.44,42.82 51.82,42.82 53.34,41.3 53.34,39.17 56.36,36.14 56.36,33.02 57.63,31.75 57.63,23.85 58.77,22.71 63.96,22.71 64.62,22.05 64.62,16.89 67.54,13.97 R3.1 | v75.25,7.94 74.93,8.26 73.53,8.26 73.19,7.92 71.23,7.92 71.09,8.06 71.09,12.92 SW1.E
  Bottom 0.152: R3.1 69.34,14.02 72.08,14.02 SW1.E 81.21,14.04 85.09,10.16 85.09,8.56 85.73,7.92 87.78,7.92 92.66,12.8 92.66,13.26 CON1.2 | U2.A6 36.98,50.65 41.1,50.65 41.76,49.99 41.76,49.68 44.45,46.99 C4.1 | SV3.3 78.15,3.6 77.51,3.6 76.75,4.36 76.75,6.43 v75.25,7.94
CAN_H
  Top 0.152: CAN1.9 2.59,64.77 2.59,63.86 3.38,63.07 3.38,62.97 3.66,62.69 3.66,61.44 3.17,60.96 3.17,46.03 4.93,44.28 4.93,43.66 6.35,42.23 CON2.3
CAN_L
  Top 0.152: CAN1.8 2.59,62.18 2.59,42.52 3.81,41.3 CON2.4
D11
  Bottom 0.152: SV2.7 6.35,51.18 4.6,52.93 4.6,63.91 5.74,65.05 7.52,65.05 10.64,68.17 10.64,70.33 11.43,71.12 25.08,71.12 26.19,70.01 26.19,69.39 26.84,68.73 27.79,68.73 CAN1.5 30.48,67 31.6,68.12 31.6,70.54 34.33,73.27 35.81,73.27 37.15,74.61 48.58,74.61 U2.D11
D12
  Bottom 0.152: U$1.STEP 12.19,69.8 12.95,69.8 14.07,68.68 24.97,68.68 25.88,67.77 25.88,66.47 26.47,65.89 28.14,65.89 30.48,63.55 CAN1.4 30.48,64.46 31.9,65.88 31.9,70.31 33.1,71.51 36.58,71.51 37.1,72.02 37.1,73.94 37.47,74.31 48.45,74.31 49.26,73.5 49.26,72.02 49.78,71.51 51.82,71.51 52.34,72.02 52.34,72.76 50.8,74.29 U2.D12
DCC1
  Top 0.61: X1.2 72.31,75.03 72.31,74.75 77.06,70 77.06,63.18 79.33,60.91 80.7,60.91 REL1.O2
  Bottom 0.152: R8.2 44.14,77.47 45.26,78.59 46.18,78.59 46.84,77.93 46.84,77.31 47.72,76.42 52.07,76.42 52.45,76.05 70.99,76.05 X1.2
  Bottom 0.508: JMP1.2 77.37,78.11 76.75,78.73 72.39,78.73 71.14,77.48 X1.2
  Bottom 0.61: NO_POL2.2 REL1.O2 81.92,57.15 REL1.S1
DCC2
  Top 0.61: REL1.O1 81.92,54.61 REL1.S2 84.4,59.69 82.42,61.67 79.65,61.67 77.83,63.49 77.83,74.55 X1.1
  Bottom 0.152: D2.C 47.07,76.12 51.95,76.12 52.69,75.37 52.69,74.63 53.51,73.81 72.54,73.81 73.66,74.93 X1.M
  Bottom 0.61: X1.1 78.72,73.66 JMP2.2 | NO_POL1.2 81.28,52.7 REL1.O1
  Bottom 0.813: X1.1 X1.M
DCC/SX
  Top 0.152: R21.1 24.23,25.91 24.23,23.32 24.69,22.86 IC2.7 | OK1.6 48.92,59.16 48.92,51.41 U2.D2
  Bottom 0.152: IC2.7 24.84,22.86 27.43,20.27 27.43,19.05 SJ_SX2.2 27.58,19.05 27.58,18.44 27.89,18.14 27.94,18.14 27.99,18.19 28.8,18.19 29.21,18.59 29.21,21.27 29.53,21.59 39.06,21.59 40.18,20.47 45.01,20.47 50.14,25.6 50.14,30.48 50.01,30.61 50.01,30.94 49.21,31.75 44.21,31.75 42.7,33.26 42.7,34.11 48.84,40.25 55.95,40.25 56.54,40.84 56.54,46.79 53.8,49.53 U2.D2
  Bottom 0.254: NO_OPTO.1 44.65,61.21 OK1.6
DIR  (via drill 0.35)
  Top 0.152: U$5.DIR 67.82,26.06 61.11,32.77 61.11,36.73 61.72,37.34 62.48,37.34 63.4,38.25 63.4,44.81 61.11,47.09 61.11,51.36 56.52,55.96 v56.52,56.52
  Bottom 0.152: U2.D5 52.07,58.42 54.61,58.42 v56.52,56.52
DIR_FLASH  (via drill 0.35)
  Top 0.152: R9.1 40.69,13.87 40.69,11.43 41.91,10.21 OK3.1 | CON3.6 95.25,44.35 94.34,44.35 93.12,43.13 92.2,43.13 87.94,38.86 87.94,8.16 87.69,7.92 77.72,7.92 77.09,7.29 66.37,7.29 v65.41,8.26
  Bottom 0.152: OK3.1 42.72,10.97 42.78,10.97 43.09,11.28 53.51,11.28 54.29,12.06 64.14,12.06 65.41,10.79 v65.41,8.26
ENAB_STEP  (via drill 0.35)
  Top 0.152: v60.81,45.26 60.81,51.21 60.66,51.36 54.86,51.36 52.73,53.49 52.73,57.15 50.9,58.98 50.9,59.59 U2.D6 | R2.1 73.66,44.45 v73.66,55.88
  Bottom 0.152: CON3.14 95.25,35.2 96.77,36.73 96.77,43.18 96.37,43.59 96.37,49.99 95.68,50.68 95.68,56.11 93.67,58.12 93.62,58.12 93.5,58.24 89.08,58.24 87.99,59.33 87.99,60.86 87.41,61.44 83.12,61.44 82.55,62.01 82.55,62.03 80.75,62.03 80.16,61.44 76.42,61.44 76.09,61.11 76.05,61.11 73.66,58.73 v73.66,55.88 | R2.1 70.99,42.55 68.58,44.96 66.04,44.96 64.9,43.81 JP4.3 63.32,45.26 v60.81,45.26 60.81,34.77 JP20.1
GND
  Top 0.152: SV1.2 18.14,2.59 16,2.59 SV1.1
  Top 0.457: U$1.GND 9.53,56.52 SV2.6 | JP7.3 24.77,66.57 26.04,65.3 26.04,64.24 26.78,63.5 27.83,63.5 29.21,62.12 29.21,60.43 30.48,59.16 CAN1.2 | OK2.2 19.68,74.19 20.95,72.92 20.95,69.32 19.68,68.05 JP5.3
  Top 0.61: MOD2.7 11.43,31.75 12.78,30.4 12.78,29.29 11.46,27.97 11.46,22.5 12.45,21.51 12.45,19.76 X5.4 | X5.4 X5.6 X5.8 11.1,7.15 SV1.1 | X5.4 11.73,17.78 X3.2 | R13.2 43.81,47.63 42.47,48.97 42.47,50.09 42.6,50.22 42.6,54.56 Q1.S
  Top 0.813: U$6.1 46.19,25.42 46.2,25.41 46.2,15.72 R11.2 44.45,10.13 43.03,8.71 43,8.71 OK3.2 38.12,7.62 U$7.1 | R24.1 IC2.4 | MOD1.11 33.69,36.87 33.69,39.87 35.56,41.74 U2.GND | C11.2 77.47,29.07 76.02,30.52 76.02,31.71 77.47,33.16 C10.2 | C7.2 80.01,18.44 SW1.GND2 79.21,11.43 74.6,11.43 SW1.D | IC1.GND 59.69,55.88 C1.2 C2.2 62.23,54.61 C3.2 64.77,47.62 64.77,45.86 66.22,44.41 66.22,43.22 64.77,41.77 JP1.3 JP2.3 JP3.3
  Bottom 0.152: R15.2 85.09,63.5 B1.-
  Bottom 0.457: U$1.GNDMOT 26.04,58.42 CAN1.2 | JP7.3 JP6.3 | JP6.3 JP5.3 | JP6.3 20.95,66.04 20.95,56.52 20.32,55.88 16.51,55.88 16.51,55.99 15.88,56.62 15.88,60.33 15.24,60.96 12.29,60.96 11.68,60.35 10.19,60.35 C13.2 U$1.GND
  Bottom 0.61: U$5.GND 88.9,34.29 | 88.9,34.29 91.44,36.83 CON3.11 | MOD2.7 8.26,35.56 CAN_GND.2 | SJ_SX4.2 15.88,17.14 15.24,16.51 13.97,16.51 13.01,17.48 X3.2 | 45.72,26.67 U$6.1 | 88.9,34.29 88.94,34.25 | 71.12,64.08 C5.- | C12.2 24.77,55.24 U$1.GNDMOT
  Bottom 0.813: C2.2 65.86,50.98 67.68,50.98 69.04,49.62 69.04,45.76 69.89,44.91 71.44,44.91 77.47,38.88 C10.2 78.11,38.73 U$5.GNDMOT | IC1.GND 60.91,60.27 60.91,60.36 62.9,62.36 65.63,62.36 67.35,64.08 71.12,64.08 72.83,65.79 80.06,65.79 81.71,64.14 B1.- | U2.GND R17.2 38.59,41.91 40.04,40.46 41.24,40.46 42.69,41.91 R13.2 C4.2 48.93,43.85 48.93,44.95 50.8,46.82 U2.GND1 51.44,46.99 R12.2 | 45.72,26.67 43.04,26.67 39.23,30.48 C6.2 35.74,31.57 35.71,31.57 32.36,34.92 MOD1.11 MOD2.10 27.3,30.48 C9.2 20.95,30.48 MOD1.6 13.97,34.92 MOD2.7 | R11.2 42.55,12.06 R24.1 | OK3.2 44.94,7.62 48.93,3.63 50.13,3.63 50.98,4.48 50.98,5.4 53.2,7.62 OK4.2 | C7.2 C8.2 C11.2 U$5.GND 81.25,26.64 81.34,26.64 88.94,34.25 | 88.94,34.25 91.53,36.83 CON3.11 | CON1.7 95.25,21.34 96.77,22.86 96.77,26.42 88.94,34.25 | C1.2 56.02,55.24 54.58,56.69 53.38,56.69 52.62,55.94 49.6,55.94 OK1.5 45.32,57.13 42.55,57.13 | Q1.S 42.55,57.13 | CAN1.2 37.45,58.42 38.74,57.13 42.55,57.13 | SW1.GND1 75.61,9.04 SW1.D 74.13,7.12 SV3.5 | SW1.C 85.3,11.54 84.77,12.06 84.77,15.88 83.01,17.64 SW1.GND2
  pour Bottom: 0,77.47 2.54,80.01 3.81,80.01 97.79,80.01 100.33,77.47 100.33,3.81 96.52,0 2.54,0 0,2.54 0,3.81
LIGHT  (via drill 0.35)
  Top 0.152: v42.22,58.06 42.22,55.78 41.5,55.07 41.5,50.39 41.76,50.14 41.76,47.94 42.71,46.99 42.71,42.38 42.7,42.37 42.7,41.45 43.18,40.96 43.18,38.51 44.3,37.39 44.3,31.9 45.27,30.93 47.65,30.93 48.1,30.48 LED3.A 49.07,30.48 52.43,27.13 52.43,26.36 55.78,23.01 55.78,21.64 R10.2
  Bottom 0.152: U2.D10 48.01,67.06 48.01,60.66 47.24,59.89 44.04,59.89 v42.22,58.06
LIGHT&FLASH
  Top 0.152: D3.A 58.73,12.7 56.34,15.09 55.42,15.09 53.03,12.7 D4.C
  Bottom 0.152: CON3.8 95.25,41 93.88,39.62 93.88,38.86 92.96,37.95 91.75,37.95 81.08,27.28 65.38,27.28 64.77,26.67 64.77,26.04 | DIR_LIGHT.2 64.77,26.04 | 64.77,26.04 63.5,26.04 63.14,25.68 63.14,23.77 52.7,13.34 D4.C
N$1
  Top 0.152: JP5.2 19.66,64.77 19.66,65.75 18.57,66.85 18.57,67.77 19.68,68.89 U$1.MS3
N$2
  Bottom 0.61: X5.3 9.75,20.88 9.75,21.51 10.54,22.3 11.66,22.3 13.64,20.32 15.24,20.32 15.88,19.68 SJ_SX4.1
N$3  (via drill 0.35)
  Top 0.152: v6.25,34.59 6.25,36.27 3.81,38.71 CON2.2 | CAN1.11 2.59,69.8 2.59,68.89 3.35,68.12 3.35,68.08 3.96,67.47 3.96,61.32 3.81,61.16 3.81,46.35 CON2.5
  Bottom 0.152: v6.25,34.59 7.16,35.51 CAN_GND.1 | CON2.2 3.81,39.62 5.18,41 5.18,42.67 6.25,43.74 CON2.5
N$4
  Bottom 0.457: MOD1.12 30.48,36.2 28.68,36.2 28.05,35.56 C9.1 R1.2 17.67,35.56 17.04,36.2 13.34,36.2 12.7,36.83 12.7,46.35 MOD2.1
  Bottom 0.813: C6.1 36.2,33.02 MOD1.12
N$5
  Bottom 0.152: CON1.8 92.81,20.88 93.57,20.88 94.79,19.66 96.98,19.66 98.74,21.43 98.74,67.37 92.51,73.61 83.97,73.61 83.06,72.69 78.12,72.69 77.31,73.51 52.86,73.51 52.39,73.98 52.39,75.25 51.82,75.81 49.78,75.81 48.9,74.93 U2.D13 | U$1.DIR 11.11,71.44 11.12,71.42 17.78,71.42 18.57,72.21 18.57,72.85 19.22,73.51 20.15,73.51 20.8,72.85 20.8,72.21 21.59,71.42 26.69,71.42 26.84,71.27 29.05,71.27 | U2.D13 35.56,74.72 | 29.05,71.27 30.02,72.24 32.87,72.24 U2.D13 | CAN1.6 29.05,70.01 29.05,71.27
N$6
  Top 0.152: MOD1.15 31.7,44.96 30.79,44.96 29.49,43.66 28.75,43.66 28.09,43.01 28.09,38.25 26.67,36.83 17.46,36.83 16.97,36.35 14.43,36.35 11.89,33.81 11.25,33.81 10.97,33.53 10.95,33.5 10.21,32.77 10.21,31.09 11.43,29.87 MOD2.8
  Bottom 0.152: MOD2.8 8.89,32.38 5.71,32.38 CON8.1
N$7
  Top 0.152: MOD1.9 31.85,29.72 31.85,27.43 38.86,20.42 41.15,20.42 42.67,21.95 42.67,36.27 43.13,36.73 R5.1
  Bottom 0.152: MOD2.2 11.43,45.52 10.31,46.64 10.31,48.61 10.45,48.74 12.41,48.74 13.97,47.19 13.97,39.37 14.76,38.58 32.21,38.58 33.97,36.83 R5.1
N$8
  Top 0.254: OK2.1 25.65,77.47 26.82,78.64 27.79,78.64 28.96,77.47 LED1.K
N$9
  Top 0.152: MOD1.16 31.7,47.55 30.79,47.55 29.44,46.2 28.75,46.2 27.79,45.24 27.79,39.22 26.67,38.1 17.46,38.1 16.97,38.58 15.09,38.58 MOD2.6
  Bottom 0.152: CON8.2 6.62,35.83 6.62,36.29 6.76,36.42 8.48,36.42 9.98,34.92 MOD2.6
N$10
  Top 0.152: CON2.6 3.81,42.98 5.18,41.6 5.18,39.93 6.25,38.86 CON2.1
  Bottom 0.152: CON2.6 3.81,65.23 2.59,66.45 2.59,67.21 CAN1.10
N$11
  Top 0.152: U2.TX0 50.75,39.32 50.75,36.88 R5.2
N$12
  Top 0.813: X2.2 82.58,67.33 B1.AC2
  Bottom 0.61: X2.2 80.67,78.11 JMP1.1
N$13
  Top 0.813: X2.M 85.09,69.85 B1.AC1
  Bottom 0.61: JMP2.1 81.94,73.66 81.95,73.65 83.2,73.65 84.08,74.53 84.08,75.19 X2.M
  Bottom 0.813: X2.1 X2.M
N$14
  Bottom 0.152: JP2.2 62.33,38.71 63.09,38.71 64.31,37.49 66.6,37.49 67.82,38.71 U$5.MS2
N$15
  Top 0.254: D2.A 45.72,67.69 OK1.3
N$16
  Top 0.152: R11.1 43.18,22.86 43.18,29.84 LED2.K
N$17
  Top 0.152: REL1.1 69.19,52.12 69.19,54.41 67.21,56.39 62.64,56.39 61.11,57.91 61.11,60.35 59.74,61.72 53.21,61.72 52.86,62.08 52.86,67.16 51.82,68.19 49.78,68.19 47.98,66.39 47.98,65.83 47.33,65.18 46.7,65.18 45.09,63.56 Q1.D | R16.2 78.18,46.48 78.18,48.77 D5.A
  Bottom 0.152: REL1.1 69.34,51.97 71.12,51.97 74.88,48.21 74.88,44.83 77.01,42.7 81.11,42.7 81.76,43.35 81.76,44.28 81.11,44.93 79.53,44.93 R16.2
N$18
  Top 0.254: LED1.A 33.02,72.39 R4.1
N$19
  Top 0.152: OK2.4 23.5,76.2 X4.1 X4.M
N$20
  Bottom 0.254: X4.2 12.17,77.55 12.17,77.57 13.23,78.64 23.6,78.64 OK2.5
N$21
  Top 0.254: R8.1 40.64,65.15 OK1.2
  Bottom 0.254: OK1.2 40.13,62.87 NO_OPTO.2
N$22
  Bottom 0.152: U$5.MS1 66.75,40.08 64.31,40.08 63.25,41.15 62.33,41.15 JP1.2
N$23
  Top 0.152: LED3.K 54.61,30.48 55.24,31.11 R12.1
N$24
  Top 0.152: LED4.A 56.54,30.48 57.3,29.72 57.3,22.71 58.42,21.59 R14.2
N$25
  Bottom 0.152: JP4.2 63.19,43.81 64.31,42.7 65.23,42.7 66.35,43.81 U$5.ENABLE
N$26
  Top 0.61: X5.2 9.83,20.95 X5.1
  Bottom 0.61: X5.1 9.02,22.68 9.05,22.68 11.77,25.4 | X3.3 11.77,25.4 | SJ_SX3.1 8.26,28.12 9.05,28.12 11.77,25.4
N$27
  Top 0.152: JP3.2 62.33,36.12 63.25,36.12 64.31,35.05 66.75,35.05 67.82,36.12 U$5.MS3
N$28
  Top 0.152: OK3.4 49.53,5.18 52.58,5.18 D4.A
N$29
  Bottom 0.152: D3.C 66.04,5.08 OK4.5
N$30
  Bottom 0.152: JP20.2 63.19,33.66 64.31,34.77 65.23,34.77 66.35,33.66 U$5.RESET
N$31
  Top 0.406: CON3.1 92.71,57.15 91.44,58.42 91.44,61.45 92.19,62.2 93.95,62.2 J10.2 | U$5.M2AB 83.82,38.73 CON4.2
  Bottom 0.406: CON3.1 90.73,47.55 85.69,47.55 83.77,45.63 83.77,42.01 81.33,39.58 81.33,39.42 U$5.M2AB
N$32
  Top 0.152: JP21.3 U$1.SLEEP
N$33
  Bottom 0.152: JP20.3 67.31,31.11 U$5.SLEEP
N$34
  Bottom 0.152: R15.1 89.53,72.39 LED5.K
N$35
  Top 0.406: J10.4 95.25,51.29 96.5,50.05 96.5,43.2 96.52,43.18 96.5,43.16 94.73,43.16 93.49,41.91 CON3.7
  Bottom 0.406: U$5.M1B 84.45,34.92 CON4.1 86.73,34.92 91.47,39.66 91.47,39.89 92.71,41.13 CON3.7
N$36
  Top 0.152: R16.1 70.41,46.48 67.21,46.48 66.75,46.94 LED7.K
N$37
  Top 0.152: OK4.1 55.93,10.21 55.93,13.87 R10.1
  Bottom 0.152: R10.1 55.88,15.55 63.04,22.71 64.3,22.71 64.77,23.18 DIR_LIGHT.1
N$38
  Top 0.152: 27.28,22.86 27.28,25.91 R23.1 | 27.28,22.86 27.28,17.68 24.84,15.24 IC2.2 24.69,15.24 24.69,14.53 R24.2 | 27.28,22.86 IC2.6
N$39
  Top 0.152: R25.1 29.72,8.99 29.72,10.52 27.43,12.8 27.43,15.24 IC2.3
  Bottom 0.152: IC2.3 27.13,15.24 SJ_SX1.1
N$40
  Top 0.406: J10.1 91.44,63.5 90.17,62.23 90.17,57.15 91.47,55.85 91.47,48.49 92.71,47.25 CON3.3
  Bottom 0.406: U$5.M2A 80.64,36.98 81.89,38.22 81.89,39.34 CON4.4 89.53,46.99 CON3.3
N$41
  Top 0.406: CON3.5 93.98,45.72 93.98,59.69 J10.3
  Bottom 0.406: U$5.M1A 82.55,35.56 82.55,38.1 84.45,40.01 CON4.3 89.53,44.45 CON3.5
N$42
  Top 0.152: IC2.5 R28.1
  Bottom 0.152: SJ_SX2.1 28.5,19.05 28.5,21.64 29.72,22.86 IC2.5
N$43
  Top 0.152: JP6.2 22.1,64.77 22.1,65.84 21.03,66.9 21.03,68.73 22.1,69.8 U$1.MS2
N$44
  Top 0.152: JP7.2 24.69,64.77 24.69,65.68 23.62,66.75 23.62,68.73 24.69,69.8 U$1.MS1
N$45
  Top 0.152: U$1.ENABLE 27.3,68.89 26.19,67.77 26.19,66.85 27.3,65.73 JP8.2
N$46
  Top 0.152: JP21.2 17.14,65.73 18.26,66.85 18.26,67.77 17.3,68.73 17.3,69.69 U$1.RESET
N$47
  Top 0.457: 17.14,58.42 20.21,58.42 21.48,57.15 U$1.M2AB | 17.14,58.42 16.62,58.42 15.88,57.68 15.88,56.62 15.24,55.99 CON5.2 15.88,53.34 17.22,51.99 17.25,51.99 19.71,49.53 19.71,41.36 21.06,40.01 22.12,40.01 22.86,40.75 22.86,42.55 J1.2 | SV2.1 7.51,66.04 11.98,61.57 15.38,61.57 17.14,59.81 17.14,58.42
N$48
  Top 0.457: U$1.M2A 19.68,53.98 CON5.4 21.59,52.07 J1.1
  Bottom 0.457: SV2.2 17.78,63.5 18.41,62.87 18.41,58.42 U$1.M2A
N$49
  Top 0.457: U$1.M1A 17.14,53.98 CON5.3 20.32,50.8 20.32,42.55 J1.3
  Bottom 0.457: SV2.3 11.43,60.96 12.04,61.57 15.49,61.57 16.48,60.58 16.48,57.81 U$1.M1A
N$50
  Top 0.152: 14.48,57.15 U$1.M1B
  Top 0.457: SV2.4 10.16,58.42 12.7,60.96 15.13,60.96 15.88,60.22 15.88,58.55 14.48,57.15 14.48,55.12 CON5.1 13.34,53.34 19.05,47.63 19.05,41.16 20.81,39.4 22.37,39.4 23.47,40.5 23.47,40.62 J1.4
PE
  Top 0.152: X3.PE@ 2.9,15.24 2.9,20.27 X3.PE
POLAR
  Top 0.152: U2.A1 35.66,64.77 35.66,64.16 38.1,61.72 38.1,60.66 38.86,59.89 41.3,59.89 43.74,57.45 43.74,52.73 Q1.G 43.89,52.58 43.89,49.53 R13.1
POTI  (via drill 0.35)
  Top 0.152: R17.1 37.19,49.53 | 37.19,49.53 U2.A7 | v26.06,7.77 26.06,16 28.42,18.36 28.42,27.36 30.63,29.57 30.63,40.54 31.39,41.3 32.16,41.3 33.98,43.13 33.98,44.81 35.2,46.02 36.58,46.02 37.19,46.63 37.19,49.53
  Bottom 0.152: SV1.3 20.88,2.59 v26.06,7.77 29.23,10.95 30.31,10.95 30.64,11.28 42.66,11.28 42.96,11.58 53.17,11.58 53.81,12.23 54.02,12.23 54.17,12.37 61.9,12.37 62.38,12.85 62.38,14.43 63.04,15.09 63.35,15.09 68.58,20.32 68.58,20.64 68.1,21.13 68.1,22.63 69.09,23.62 72.69,23.62 75.29,21.03 85.5,21.03 86.72,22.25 93.27,22.25 94.49,23.47 95.25,23.47 CON1.9 | R17.1 R18.2
S88_TURN
  Top 0.152: U2.A2 35.51,62.33 33.07,62.33 R4.2
SCL  (via drill 0.35)
  Top 0.152: CON3.10 95.25,38.56 94.03,37.34 94.03,17.22 95.25,16 CON1.3 95.25,15.54 94.03,14.33 94.03,12.95 88.69,7.62 77.85,7.62 77.22,6.99 65.41,6.99 64.62,6.2 64.62,4.62 63.96,3.96 61.82,3.96 61.28,4.5 59.55,4.5 59.01,3.96 v42.82,3.96 | v47.4,30.33 51.05,26.67 U$6.3 | v45.26,19.81 44.81,19.81 33.07,8.08 33.07,7.62 U$7.3 | U2.A5 39.22,50.95 39.22,48.94 41.91,46.25 v41.91,39.37
  Bottom 0.152: U$6.3 51.21,26.67 51.21,25.76 v45.26,19.81 | v42.82,3.96 41,3.96 37.34,7.62 U$7.3 | v41.91,39.37 42.32,39.37 44.3,37.39 44.3,36.37 42.39,34.46 42.39,30.32 43.35,29.36 44.28,29.36 45.24,30.33 v47.4,30.33
SDA  (via drill 0.35)
  Top 0.152: CON1.1 95.25,14.17 96.47,15.39 96.47,35.51 95.25,36.73 CON3.12 | 57,21.03 56.39,20.42 55.32,20.42 50.14,25.6 50.14,26.98 49.23,27.89 45.26,27.89 44.96,27.58 44.96,25.76 45.57,25.15 45.57,21.03 34.75,10.21 33.07,10.21 U$7.4 | 57,21.03 57,23.62 53.95,26.67 U$6.4 53.65,26.67 50.01,30.3 50.01,30.94 49.36,31.6 45.87,31.6 45.11,32.36 45.11,52.07 46.99,53.95 v46.99,55.88 | v68.28,12.8 60.66,20.42 57.61,20.42 57,21.03
  Bottom 0.152: U2.A4 36.83,57.15 40.36,53.62 42.95,53.62 43.54,54.2 43.54,54.46 44.95,55.88 v46.99,55.88 | CON1.1 95.25,13.26 94.34,13.26 88.54,7.47 85.75,7.47 84.78,8.43 84.78,10.03 82.02,12.8 v68.28,12.8
STATUS  (via drill 0.35)
  Top 0.152: v87.33,28.96 87.33,44.65 85.65,46.33 85.34,46.33 80.92,50.75 80.92,58.56 76.53,62.96 76.53,68.25 71.17,73.61 49.99,73.61 47.85,71.48 40.54,71.48 36.42,67.36 35.66,67.36 U2.A0
  Bottom 0.152: v87.33,28.96 92.66,23.62 CON1.10
STEP
  Top 0.152: U$5.STEP 67.97,28.65 69.19,29.87 69.19,44.15 67.47,45.87 66.21,45.87 65.56,46.53 65.56,48.23 65.53,48.26 65.53,53.03 60.81,57.76 60.81,60.2 59.59,61.42 53.08,61.42 52.55,61.95 52.55,65.56 U2.D9
SW_A  (via drill 0.35)
  Top 0.152: v69.34,23.01 66.75,25.6 66.75,26.67 61.82,31.6 59.05,31.6 56.97,33.68 56.97,36.45 53.95,39.47 53.95,50.19 52.07,52.07 U2.D3 | v81.28,8.89 81.43,9.04 SW1.A
  Bottom 0.152: CON1.6 92.66,18.29 91.44,17.07 91.44,13.87 86.72,9.14 SW1.A 81.41,14.35 73.66,14.35 73.34,14.66 73.34,15.56 72.39,16.51 C8.1 72.39,22.25 71.63,23.01 v69.34,23.01 | SV3.1 84.29,5.88 v81.28,8.89
SW_B  (via drill 0.35)
  Top 0.152: 86.56,14.17 86.56,20.73 85.19,22.1 C7.1 85.04,22.25 85.04,23.32 81.08,27.28 80.31,27.28 79.4,28.19 79.4,51.82 69.62,61.59 69.62,65 v67.31,67.31 | 86.56,14.17 SW1.B | 86.56,14.17 86.36,14.17 86.36,13.29 85.59,12.52 85.59,10.35 84.77,9.53 80.64,9.53 v80.01,8.89
  Bottom 0.152: U2.D8 50.75,64.77 50.75,65.38 49.23,66.9 49.23,67.67 49.84,68.28 53.34,68.28 53.49,68.43 66.14,68.43 66.29,68.28 66.34,68.28 v67.31,67.31 | CON1.4 92.81,16 92.81,16.76 94.03,17.98 94.03,18.9 93.27,19.66 92.2,19.66 86.72,14.17 SW1.B | SV3.2 81.05,3.24 81.05,7.14 80.01,8.18 v80.01,8.89
SX/CS_CAN  (via drill 0.35)
  Top 0.152: R22.1 IC2.1 22.25,15.24 22.25,18.75 26.06,22.55 26.06,26.37 26.84,27.15 27.47,27.15 28.07,27.75 28.07,30.35 28.96,31.24 29.72,31.24 30.33,31.85 30.33,42.82 31.39,43.89 32.16,43.89 34.02,45.76 34.02,55.21 34.75,55.93 | 34.75,55.93 30.48,60.2 CAN1.3 30.48,61.92 29.36,63.04 29.36,65.25 JP8.3 | v38.87,54.26 37.19,55.93 34.75,55.93 | R19.1 21.27,59.69 20.15,60.81 18.57,60.81 JP21.1
  Bottom 0.152: SJ_SX1.2 22.4,15.39 22.25,15.24 IC2.1 | U2.D4 50.75,54.56 47.3,54.56 44.45,51.71 43.41,51.71 42.82,52.3 42.82,52.4 41.91,53.31 39.81,53.31 v38.87,54.26 | CAN1.3 29.21,59.69 R19.1
SX_T0
  Bottom 0.152: X5.7 8.69,14.48 8.69,14.02 12.5,10.21 12.95,10.21 X3.1 15.39,7.77 22.71,7.77 28.19,13.26 29.57,13.26 31.55,15.24 R28.2
SX_T1
  Bottom 0.152: R25.2 22.1,8.99 19.2,8.99 15.54,12.65 X3.4 15.54,13.11 11.58,17.07 8.69,17.07 X5.5
T_RAIL1
  Top 0.152: 62.33,5.18 57.45,5.18 56.24,6.4 50.75,6.4 OK3.5 | 62.33,5.18 63.4,5.18 OK4.4 | 62.33,5.18 62.33,6.35 62.33,8.08 63.25,8.99 65.84,8.99 71.02,14.17 71.02,22.55 72.49,24.03 72.49,33.73 75.59,36.83 75.59,50.75 76.81,51.97 REL1.P1
  Bottom 0.406: CON3.4 95.25,47.77 93.98,49.04 93.98,50.8 91.44,50.8 88.9,48.26 83.38,48.26 80.53,51.12 77.79,51.12 REL1.P1
  Bottom 0.61: NO_POL1.1 77.47,52.7 REL1.P1
T_RAIL2
  Bottom 0.406: REL1.P2 77.83,60.68 80.01,60.68 80.9,61.57 82.38,61.57 86.14,57.81 93.32,57.81 95.25,55.88 CON3.2
  Bottom 0.61: NO_POL2.1 REL1.P2
TURN_FLASH
  Top 0.152: 41.3,30.48 41.76,30.94 41.76,36.99 42.52,37.75 42.52,39.62 42.39,39.75 42.39,46.2 39.52,49.07 39.52,51.08 39.47,51.13 39.47,55.17 35.66,58.98 35.66,59.59 U2.A3 | 41.3,30.48 LED2.A | R9.2 42.37,23.32 42.37,29.41 41.3,30.48
V+  (via drill 0.35)
  Top 0.813: IC1.IN 53.98,55.88 C1.1 53.98,53.98 D1.C | v7.62,31.75 9.98,34.11 9.98,50.62 v10.16,50.8 v11.43,50.8
  Bottom 0.152: LED5.A 85.69,69.85 85,70.54 80.7,70.54 B1.+
  Bottom 0.457: SJ_SX3.2 v7.62,31.75
  Bottom 0.813: C1.1 52.01,53.28 46.92,53.28 44.71,51.08 43.14,51.08 41.54,52.68 39.54,52.68 38.94,53.28 34.4,53.28 33.83,52.7 C12.1 31.04,51.36 29.21,51.36 | U$5.VMOT C10.1 77.47,44.94 75.51,46.9 75.51,48.47 69.83,54.15 67.63,54.15 67.28,53.8 66.08,53.8 62.9,56.97 59.14,56.97 58.37,57.75 58.37,57.84 IC1.IN 58.37,60.27 58.37,60.36 61.33,63.32 65.23,63.32 C5.+ B1.+ | U$1.VMOT 29.03,55.42 29.03,55.28 29.21,55.1 29.21,51.36 | 29.21,51.36 28.25,50.39 11.84,50.39 v11.43,50.8 v10.16,50.8
ZERO_SW
  Top 0.152: U2.D7 49.23,60.66 49.23,51.74 49.78,51.19 52.52,51.19 53.65,50.06 53.65,39.32 56.67,36.3 56.67,33.15 59.05,30.76 LED4.K
  Bottom 0.152: CON3.13 92.81,34.29 92.81,35.2 94.03,36.42 94.03,37.34 94.94,38.25 95.86,38.25 96.47,38.86 96.47,42.37 95.71,43.13 92.2,43.13 86.41,37.34 86.41,37.03 85.5,36.12 83.97,36.12 81.84,33.98 81.84,33.22 81.08,32.46 77.11,32.46 73.53,36.04 71.29,36.04 70.64,35.39 70.64,32.23 68.41,30 67.48,30 67,30.48 LED4.K

### Text on the board
Top: Top | +5V | by Hardi
Bottom: by Hardi | MobaLedLib | Bottom | GND
tPlace: Moving | - | + Moving | DCC | + | Power | GND | +5V | + | +5V | Warn L. | House | + | + | + | GND | Zero SW | Turntable Control | by Hardi | GND | +5V
bPlace: - | + | Moving => S88 | Power 16-18V | Stepper NEM17 | +5V | GND | Z-Sw | https://github.com/Hardi-St/MobaLedLib_Turntable | https://stummiforum.de/viewtopic.php?t=188668 | by Hardi | Turntable Control